# EAGLE design PCE128_rev_B (EAGLE 9.6.2)
PC Engine Joypad Breakout Version 1.0
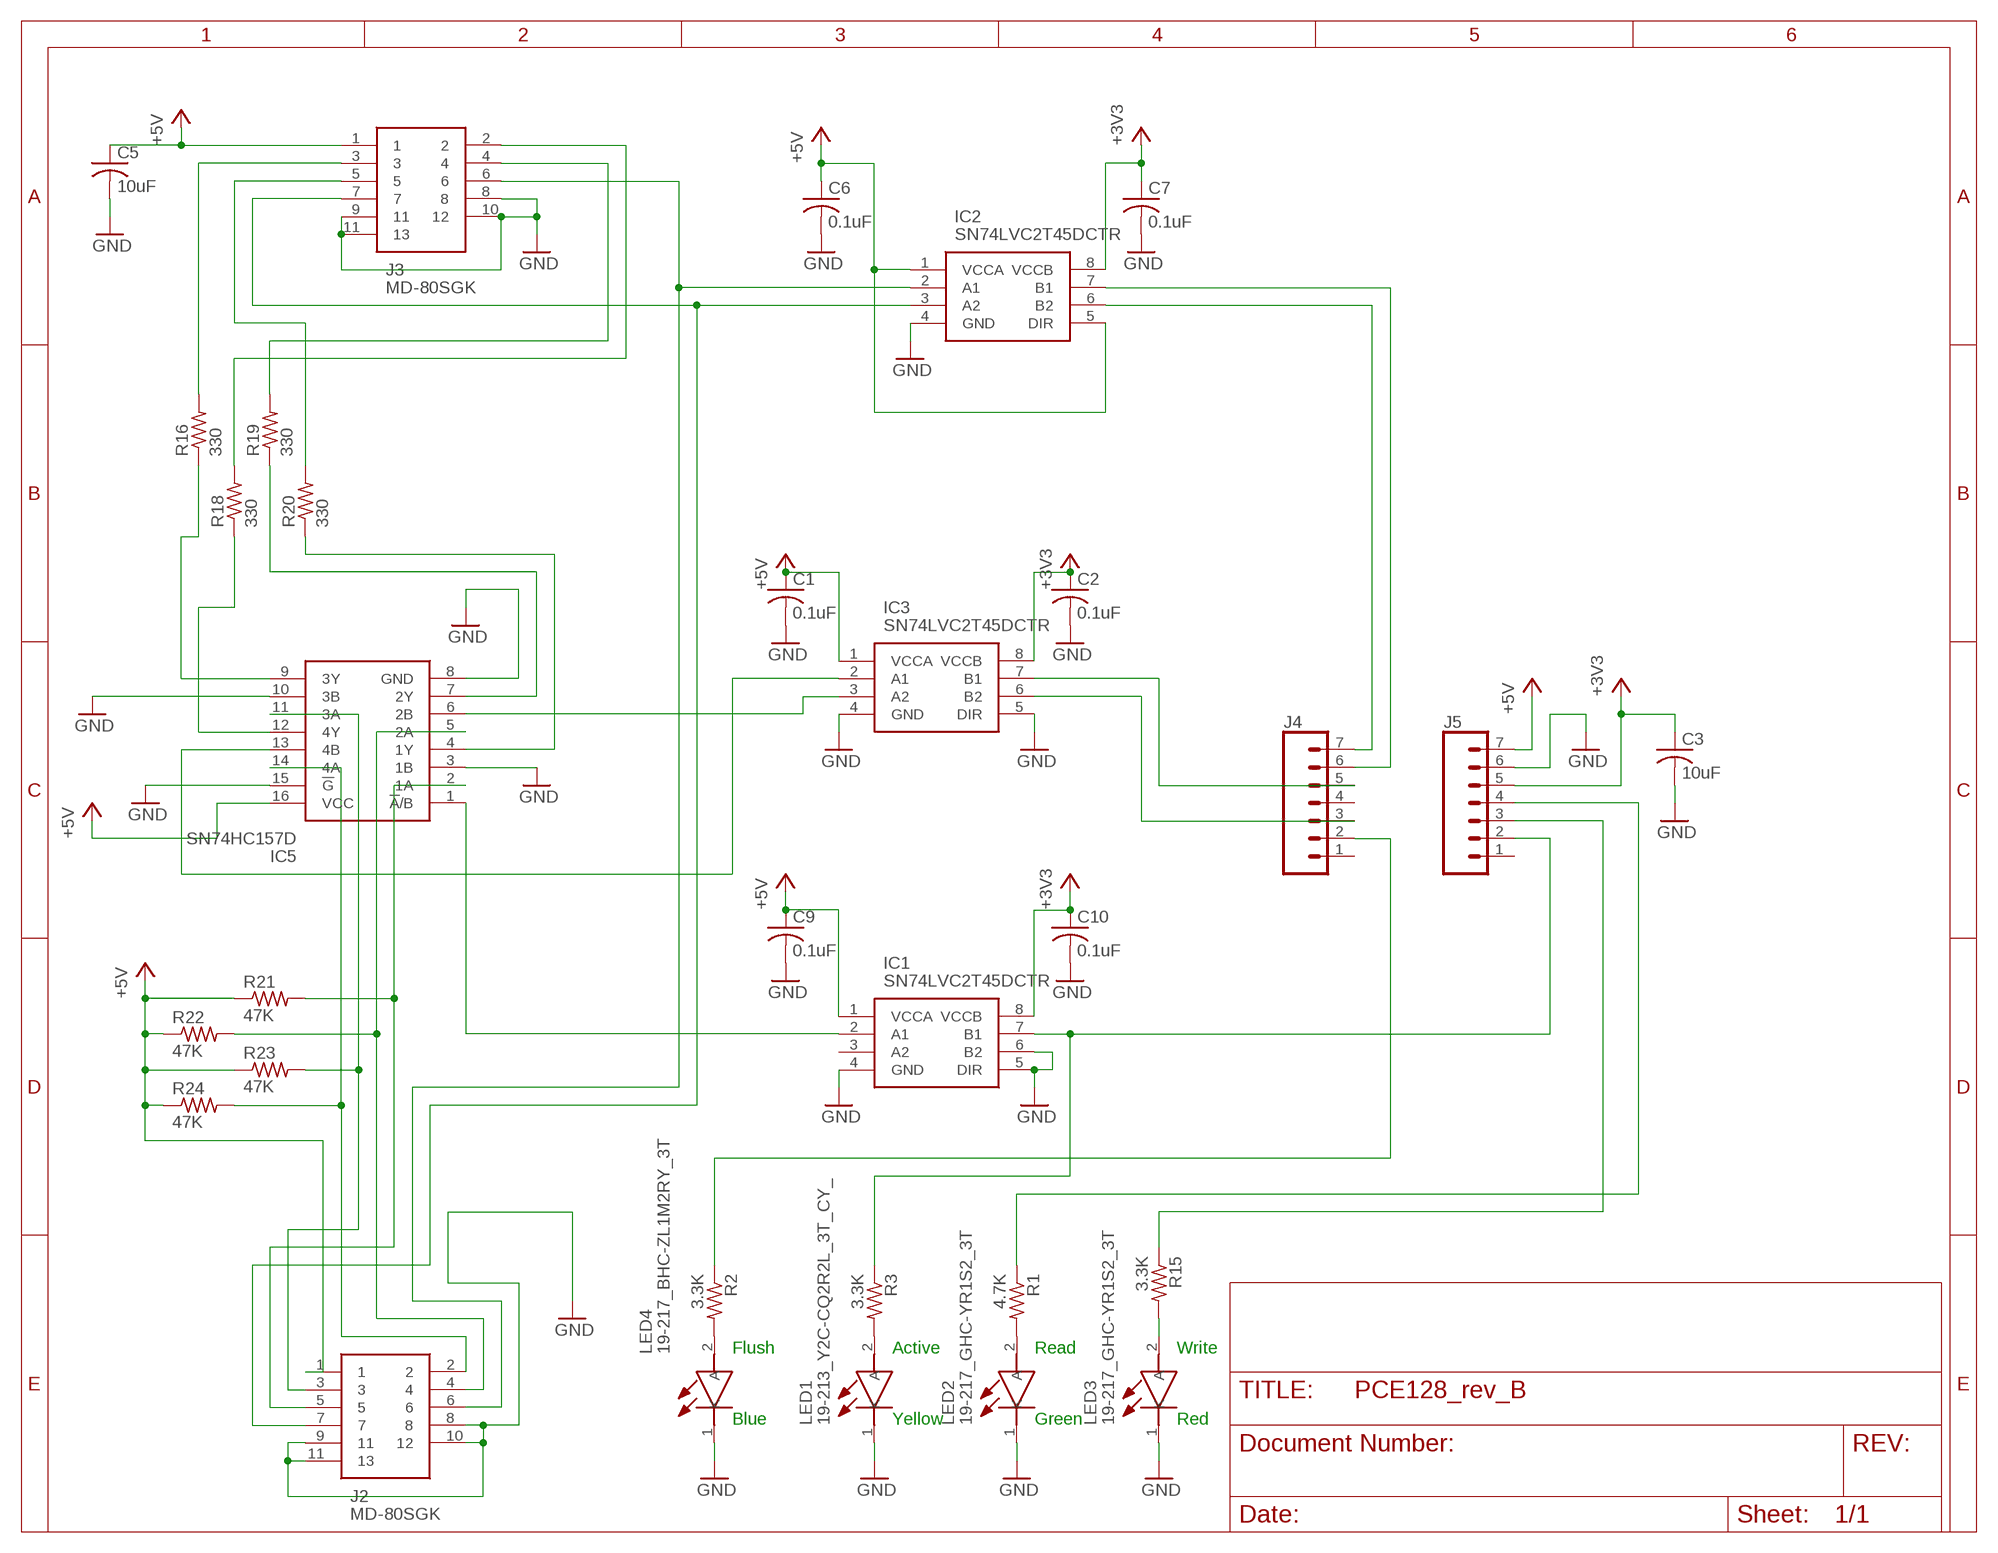
[diagram p0: schematic, sheet 1]

## Parts
C1  0.1uF  C-USC0402  [C0402]
C2  0.1uF  C-USC0402  [C0402]
C3  10uF  C-USC0805  [C0805]
C5  10uF  C-USC0805  [C0805]
C6  0.1uF  C-USC0402  [C0402]
C7  0.1uF  C-USC0402  [C0402]
C9  0.1uF  C-USC0402  [C0402]
C10  0.1uF  C-USC0402  [C0402]
IC1  SN74LVC2T45DCTR  [SOP65P400X130-8N]
IC2  SN74LVC2T45DCTR  [SOP65P400X130-8N]
IC3  SN74LVC2T45DCTR  [SOP65P400X130-8N]
IC5  SN74HC157D  [SOIC127P600X175-16N]
J2  MD-80SGK  [MD80SGK]
J3  MD-80SGK  [MD80SGK]
J4  CONN_07NO_SILK  [1X07_NO_SILK]
J5  CONN_07NO_SILK  [1X07_NO_SILK]
LED1  19-213_Y2C-CQ2R2L_3T_CY_  [LEDC1608X50N]
LED2  19-217_GHC-YR1S2_3T  [LEDC1608X50N]
LED3  19-217_GHC-YR1S2_3T  [LEDC1608X50N]
LED4  19-217_BHC-ZL1M2RY_3T  [LEDC1608X50N]
R1  4.7K  R-US_R0402  [R0402]
R2  3.3K  R-US_R0402  [R0402]
R3  3.3K  R-US_R0402  [R0402]
R15  3.3K  R-US_R0402  [R0402]
R16  330  R-US_R0402  [R0402]
R18  330  R-US_R0402  [R0402]
R19  330  R-US_R0402  [R0402]
R20  330  R-US_R0402  [R0402]
R21  47K  R-US_R0402  [R0402]
R22  47K  R-US_R0402  [R0402]
R23  47K  R-US_R0402  [R0402]
R24  47K  R-US_R0402  [R0402]

## Nets
+3V3 [power]: C2.1 C3.1 C7.1 C10.1 IC1.8(VCCB) IC2.8(VCCB) IC3.8(VCCB) J5.5
+5V [power]: C1.1 C5.1 C6.1 C9.1 IC1.1(VCCA) IC2.1(VCCA) IC2.5(DIR) IC3.1(VCCA) IC5.16(VCC) J2.1 J3.1 J5.7 R21.1 R22.1 R23.1 R24.1
CLR [signal]: IC2.3(A2) J2.7 J3.7
D0_IN [signal]: IC5.14(4A) J2.2 R24.2
D0_OUT: J3.2 R18.2
D1_IN [signal]: IC5.11(3A) J2.3 R23.2
D1_OUT: J3.3 R16.2
D2_IN: IC5.5(2A) J2.4 R22.2
D2_OUT: J3.4 R19.2
D3_IN: IC5.2(1A) J2.5 R21.2
D3_OUT: J3.5 R20.2
D6 [signal]: J5.3 R15.1
D10 [signal]: J5.4 R1.1
D11 [signal]: IC1.7(B1) J5.2 R3.1
GND: C1.2 C2.2 C3.2 C5.2 C6.2 C7.2 C9.2 C10.2 IC1.4(GND) IC1.5(DIR) IC1.6(B2) IC2.4(GND) IC3.4(GND) IC3.5(DIR) IC5.3(1B) IC5.8(GND) IC5.10(3B) IC5.15(!G) J2.8 J2.9 J2.10 J2.11 J3.8 J3.9 J3.10 J3.11 J5.6 LED1.1(K) LED2.1(K) LED3.1(K) LED4.1(K)
N$1: LED2.2(A) R1.2
N$2: J4.2 R2.1
N$3: IC3.7(B1) J4.5
N$4: LED4.2(A) R2.2
N$5: LED1.2(A) R3.2
N$6: IC3.6(B2) J4.3
N$7: IC3.3(A2) IC5.6(2B)
N$8: IC2.7(B1) J4.6
N$14: IC1.2(A1) IC5.1(!A!/B)
N$17: IC5.9(3Y) R16.1
N$20: IC5.12(4Y) R18.1
N$22: IC5.4(1Y) R20.1
N$24: IC5.7(2Y) R19.1
N$30: IC3.2(A1) IC5.13(4B)
N$32: IC2.6(B2) J4.7
N$36: LED3.2(A) R15.2
SEL [signal]: IC2.2(A1) J2.6 J3.6
Unconnected: IC1.3(A2) J4.1 J4.4 J5.1

## Notes on the sheet
- Flush | Active | Read | Write
- Blue | Yellow | Green | Red

## Library data of the parts
C1-C3 C5-C7 C9 C10 = resistor:C-US: CAPACITOR, American symbol
IC1-IC3 = SamacSys_Parts:SN74LVC2T45DCTR: 2-Bit Bus Transceiver, Translation SSOP8 SN74LVC2T45DCTR, Voltage Level Translator, Bus Transceiver LVC, 3-State 1.65 Source: Datasheet <http://www.ti.com/lit/ds/symlink/sn74lvc2t45.pdf>; DESCRIPTION: 2-Bit Bus Transceiver, Translation SSOP8 SN74LVC2T45DCTR, Voltage Level Translator, Bus Transceiver LVC, 3-State 1.65; HEIGHT: 1.3mm; MANUFACTURER_NAME: Texas Instruments; MANUFACTURER_PART_NUMBER: SN74LVC2T45DCTR; MOUSER_PART_NUMBER: 595-SN74LVC2T45DCTR; MOUSER_PRICE-STOCK: https://www.mouser.com/Search/Refine.aspx?Keyword=595-SN74LVC2T45DCTR; RS_PART_NUMBER: 9213022; RS_PRICE-STOCK: http://uk.rs-online.com/web/p/products/9213022
IC5 = PC-Engine:SN74HC157D: Quadruple 2-Line To 1-Line Data Selectors/Multiplexers Source: Datasheet <http://www.ti.com/lit/ds/symlink/sn74hc157.pdf>; ARROW_PART_NUMBER: SN74HC157D; ARROW_PRICE-STOCK: https://www.arrow.com/en/products/sn74hc157d/texas-instruments; DESCRIPTION: Quadruple 2-Line To 1-Line Data Selectors/Multiplexers; HEIGHT: 1.75mm; MANUFACTURER_NAME: Texas Instruments; MANUFACTURER_PART_NUMBER: SN74HC157D; MOUSER_PART_NUMBER: 595-SN74HC157D; MOUSER_PRICE-STOCK: https://www.mouser.co.uk/ProductDetail/Texas-Instruments/SN74HC157D?qs=UGVLDq%2F29uhSeVegTExyng%3D%3D
J2 J3 = SamacSys_Parts:MD-80SGK: Circular DIN Connectors mini-DIN, 8P jack, rt, through hole, full shield Source: Datasheet <https://www.cui.com/product/resource/md-sgk-series.pdf>; DESCRIPTION: Circular DIN Connectors mini-DIN, 8P jack, rt, through hole, full shield; HEIGHT: 13mm; MANUFACTURER_NAME: CUI; MANUFACTURER_PART_NUMBER: MD-80SGK; MOUSER_PART_NUMBER: 490-MD-80SGK; MOUSER_PRICE-STOCK: https://www.mouser.com/Search/Refine.aspx?Keyword=490-MD-80SGK
J4 J5 = SparkFun-Connectors:CONN_07: Multi connection point. Often used as Generic Header-pin footprint for 0.1 inch spaced/style header connections On any of the 0.1 inch spaced packages, you can populate with these: Break Away Headers - Straight <https://www.sparkfun.com/products/116> (PRT-00116) Break Away Male Headers - Right Angle <https://www.sparkfun.com/products/553> (PRT-00553) Female Headers <https://www.sparkfun.com/products/115> (PRT-00115) Break Away Headers - Machine Pin <https://www.sparkfun.com/products/117> (PRT-00117) Break Away Female Headers - Swiss Machine Pin <https://www.sparkfun.com/products/743> (PRT-00743) For SCREWTERMINALS and SPRING TERMINALS visit here: Screw Terimnals on SparkFun.com <https://www.sparkfun.com/search/results?term=Screw+Terminals> (5mm/3.5mm/2.54mm spacing) This device is also useful as a general connection point to wire up your design to another part of your project. Our various solder wires solder well into these plated through hole pads. Hook-Up Wire - Assortment (Stranded, 22 AWG) <https://www.sparkfun.com/products/11375> (PRT-11375) Hook-Up Wire - Assortment (Solid Core, 22 AWG) <https://www.sparkfun.com/products/11367> (PRT-11367) View the entire wire category on our website here <https://www.sparkfun.com/categories/141> Special notes: Molex polarized connector foot print use with SKU : PRT-08231 with associated crimp pins and housings. 1MM SMD Version SKU: PRT-10208 NOTES ON THE VARIANTS LOCK and LOCK_LONGPADS... This footprint was designed to help hold the alignment of a through-hole component (i.e. 6-pin header) while soldering it into place. You may notice that each hole has been shifted either up or down by 0.005 of an inch from it's more standard position (which is a perfectly straight line). This slight alteration caused the pins (the squares in the middle) to touch the edges of the holes. Because they are alternating, it causes a "brace" to hold the component in place. 0.005 has proven to be the perfect amount of "off-center" position when using our standard breakaway headers. Although looks a little odd when you look at the bare footprint, once you have a header in there, the alteration is very hard to notice. Also,if you push a header all the way into place, it is covered up entirely on the bottom side.
LED1 = PC-Engine:19-213_Y2C-CQ2R2L_3T_CY_: 0603 Package Chip LED (0.6mm Height) Source: Datasheet <https://datasheet.lcsc.com/szlcsc/Everlight-Elec-19-213-Y2C-CQ2R2L-3T-CY_C72038.pdf>; ARROW_PART_NUMBER: 19-213/Y2C-CQ2R2L/3T(CY); DESCRIPTION: 0603 Package Chip LED (0.6mm Height); HEIGHT: 0.6mm; MANUFACTURER_NAME: Everlight Elec; MANUFACTURER_PART_NUMBER: 19-213/Y2C-CQ2R2L/3T(CY)
LED2 = PC-Engine:19-217_GHC-YR1S2_3T: Standard LEDs - SMD Source: Datasheet <https://www.arrow.com/en/products/19-217ghc-yr1s23t/everlight-electronics>; ARROW_PART_NUMBER: 19-217/GHC-YR1S2/3T; ARROW_PRICE-STOCK: https://www.arrow.com/en/products/19-217ghc-yr1s23t/everlight-electronics; DESCRIPTION: Standard LEDs - SMD; HEIGHT: 0.5mm; MANUFACTURER_NAME: Everlight; MANUFACTURER_PART_NUMBER: 19-217/GHC-YR1S2/3T; MOUSER_PART_NUMBER: 638-19217GHCYR1S23T; MOUSER_PRICE-STOCK: https://www.mouser.co.uk/ProductDetail/Everlight/19-217-GHC-YR1S2-3T?qs=8cKuZ6Ok2lZjmFTUzVFjDg%3D%3D
LED3 = PC-Engine:19-217_GHC-YR1S2_3T: Standard LEDs - SMD Source: Datasheet <https://www.arrow.com/en/products/19-217ghc-yr1s23t/everlight-electronics>; ARROW_PART_NUMBER: 19-217/GHC-YR1S2/3T; ARROW_PRICE-STOCK: https://www.arrow.com/en/products/19-217ghc-yr1s23t/everlight-electronics; DESCRIPTION: Standard LEDs - SMD; HEIGHT: 0.5mm; MANUFACTURER_NAME: Hubei Kento; MANUFACTURER_PART_NUMBER: KT-0603R; MOUSER_PART_NUMBER: 638-19217GHCYR1S23T; MOUSER_PRICE-STOCK: https://www.mouser.co.uk/ProductDetail/Everlight/19-217-GHC-YR1S2-3T?qs=8cKuZ6Ok2lZjmFTUzVFjDg%3D%3D
LED4 = PC-Engine:19-217_BHC-ZL1M2RY_3T
R1-R3 R15 R16 R18-R24 = resistor:R-US_: RESISTOR, American symbol

## Net classes
0 default: width 0.152 mm, drill 0.356 mm, clearance 0.152 mm
1 power: width 0.305 mm, drill 0.356 mm, clearance 0.152 mm
2 signal: width 0.152 mm, drill 0.356 mm, clearance 0.152 mm

## Board
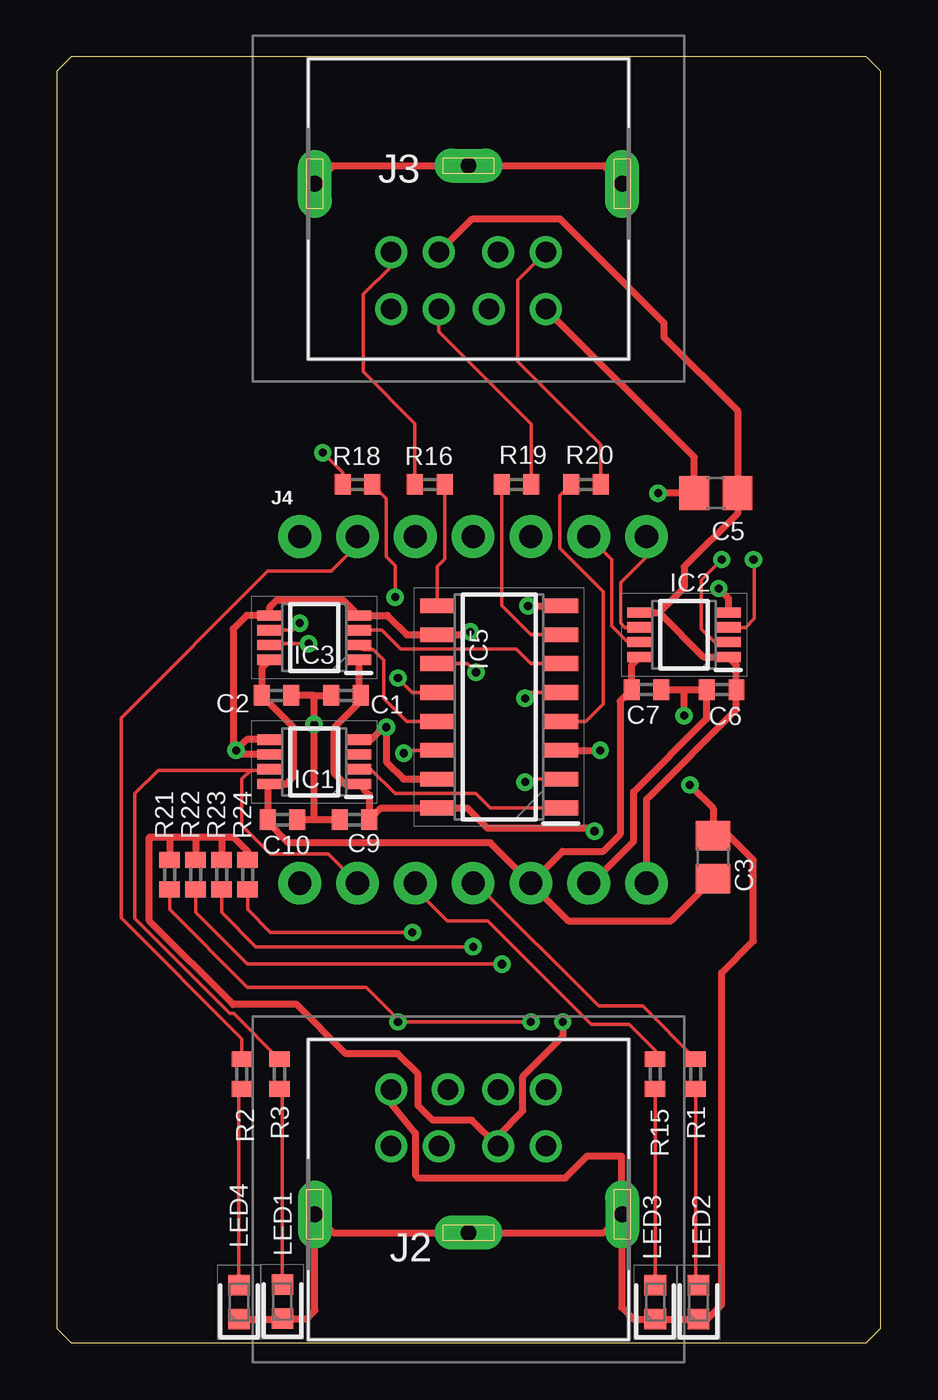
[diagram p1: board, top side]
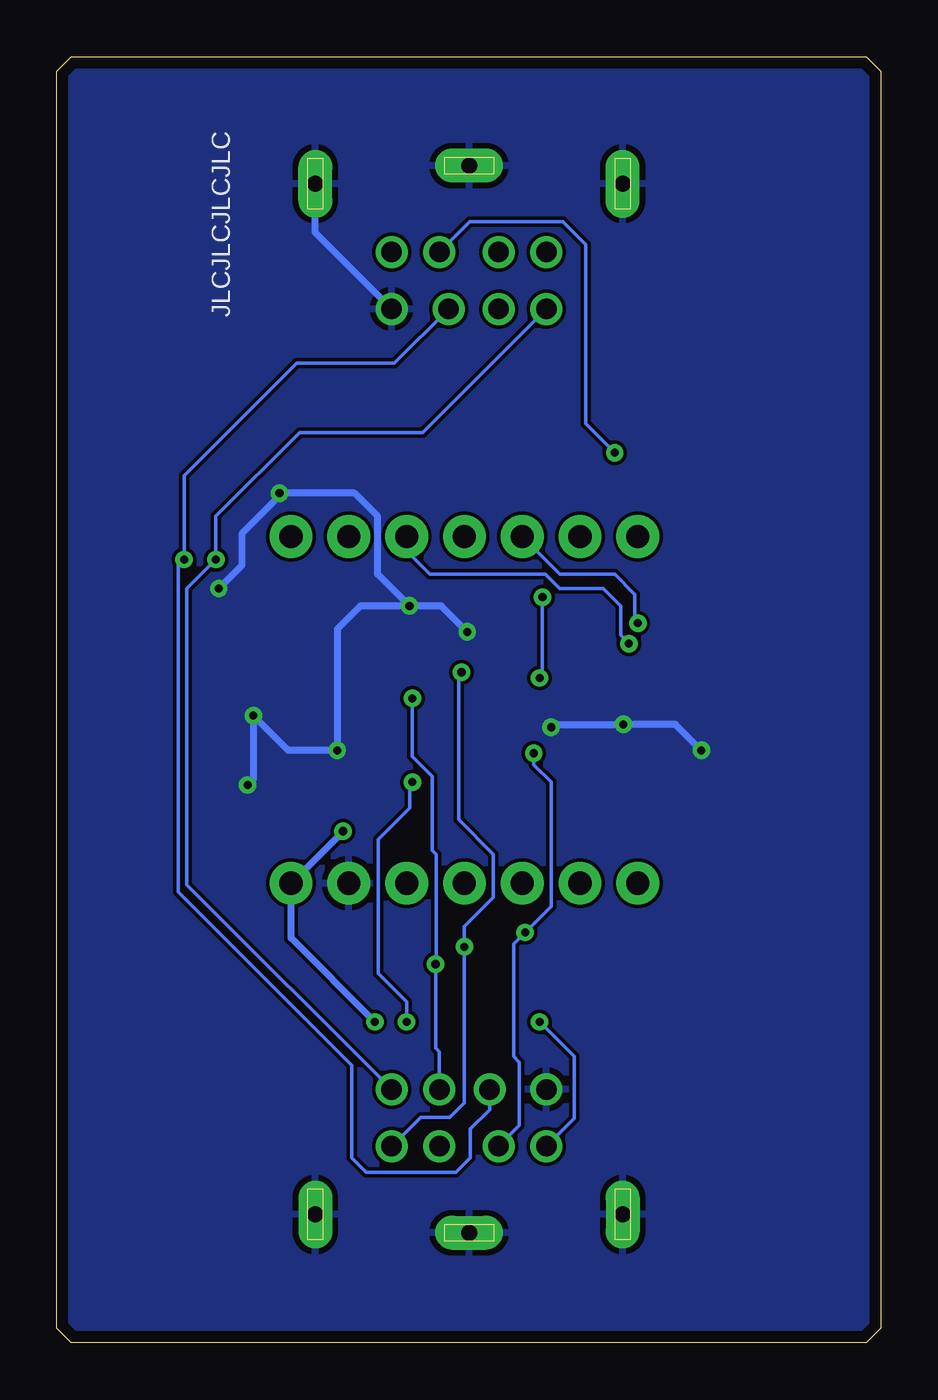
[diagram p2: board, bottom side, seen from below]

Size 36.2 x 56.52 mm. Coordinates in mm from the lower left corner, seen from the top.
Outline: 0,55.88 0,0.64 0.64,0 35.56,0 36.2,0.64 36.2,55.88 35.56,56.52 0.64,56.52 0,55.88
Copper layers (1*16): Top 0.035mm / dielectric 1.5mm / Bottom 0.035mm
Design rules "default *": minimum track width 6mil, minimum drill 0.35mm, track to track 6mil, track to pad 6mil, pad to pad 6mil, via to via 6mil, smd to smd 6mil, copper to edge 20mil, drill to drill 6mil, minimum pad ring 10mil, minimum via ring 8mil, stop-mask expansion 3mil, vias tented up to drill 18mil, thermal gap 10mil

### Footprints (pad centres in the part's own frame; a part is rotated, then mirrored left to right if it is on the bottom)
C0402 = smd 0.7 x 0.9: 1 -0.65,0; 2 0.65,0
C0805 = smd 1.3 x 1.5: 1 -0.95,0; 2 0.95,0
SOP65P400X130-8N = smd 1.1 x 0.45: 1 -1.95,0.975; 2 -1.95,0.325; 3 -1.95,-0.325; 4 -1.95,-0.975; 5 1.95,-0.975; 6 1.95,-0.325; 7 1.95,0.325; 8 1.95,0.975
SOIC127P600X175-16N = smd 1.525 x 0.65: 1 -2.712,4.445; 2 -2.712,3.175; 3 -2.712,1.905; 4 -2.712,0.635; 5 -2.712,-0.635; 6 -2.712,-1.905; 7 -2.712,-3.175; 8 -2.712,-4.445; 9 2.712,-4.445; 10 2.712,-3.175; 11 2.712,-1.905; 12 2.712,-0.635; 13 2.712,0.635; 14 2.712,1.905; 15 2.712,3.175; 16 2.712,4.445
MD80SGK = drill 0.9 pad 1.4: 1 -1.3,-1.9; 2 1.3,-1.9; 3 -3.4,-1.9; 4 -1.3,-4.4; 5 3.4,-1.9; 6 -3.4,-4.4; 7 0.9,-4.4; 8 3.4,-4.4 | drill 0.7 pad 1.5 long: 9 0,1.9; 10 -6.75,1.1; 11 6.75,1.1
1X07_NO_SILK = drill 1.016 pad 1.88: 1 0,0; 2 2.54,0; 3 5.08,0; 4 7.62,0; 5 10.16,0; 6 12.7,0; 7 15.24,0
LEDC1608X50N = smd 0.9 x 0.95: 1 -0.75,0; 2 0.75,0
R0402 = smd 0.7 x 0.9: 1 -0.65,0; 2 0.65,0

### Placement (x,y rotation side)
C1  12.7,28.45 180 top
C2  9.65,28.45 0 top
C3  28.83,21.34 90 top
C5  28.96,37.34 180 top
C6  29.21,28.7 180 top
C7  25.91,28.7 0 top
C9  13.08,22.99 180 top
C10  9.91,22.99 0 top
IC1  11.3,25.53 180 top
IC2  27.56,31.11 180 top
IC3  11.3,30.99 180 top
IC5  19.43,27.94 180 top
J2  18.08,6.73 180 top
J3  18.08,49.83 0 top
J4  10.67,35.43 0 top
J5  10.67,20.19 0 top
LED1  9.91,1.8 90 top
LED2  28.19,1.78 90 top
LED3  26.29,1.78 90 top
LED4  8,1.78 90 top
R1  28.07,11.81 270 top
R2  8.13,11.81 270 top
R3  9.78,11.81 270 top
R15  26.29,11.81 270 top
R16  16.38,37.72 180 top
R18  13.21,37.72 180 top
R19  20.19,37.72 0 top
R20  23.24,37.72 0 top
R21  4.95,20.57 270 top
R22  6.1,20.57 270 top
R23  7.24,20.57 270 top
R24  8.38,20.57 270 top

### Tracks (layer width: path | path; a pad name or v marks a point on that pad's centre or on a via)
+3V3
  Top 0.305: IC3.8 9,29.66 C2.1 10.41,27.04 10.41,24.89 10.07,24.55 IC1.8 9.26,24.45 C10.1 9.26,22.88 10.16,21.97 19.05,21.97 J5.5 | IC2.8 25.26,29.79 C7.1 24.75,28.19 24.75,22.34 24,21.59 22.23,21.59 J5.5 | J5.5 22.48,18.54 26.98,18.54 C3.1
+5V  (via drill 0.36)
  Top 0.305: IC3.1 13.25,28.55 C1.1 13.35,28.19 12.19,27.04 12.19,25.02 12.66,24.55 IC1.1 13.73,24.07 C9.1 14.24,23.5 IC5.16 18.03,23.5 18.92,22.61 23.5,22.61 v23.62,22.48 | J5.7 25.91,23.88 29.86,27.83 C6.1 29.86,29.79 IC2.1 28.41,30.14 26.46,32.09 | IC2.5 26.46,32.09 | J3.1 18.25,49.4 22.1,49.4 26.67,44.83 26.67,44.2 29.91,40.96 C5.1 29.91,36.45 27.56,34.1 27.56,33.19 26.46,32.09 | v22.23,14.1 22.23,13.46 20.48,11.71 20.48,10.19 19.39,9.1 J2.1 18.24,9.78 16.51,9.78 15.88,10.41 15.88,11.81 14.99,12.7 12.7,12.7 10.54,14.86 7.75,14.86 4.06,18.54 4.06,22.23 4.95,22.23 | 4.95,22.23 6.1,22.23 | 6.1,22.23 7.24,22.23 | 7.24,22.23 7.75,22.23 8.38,21.59 R24.1 | 7.24,22.23 R23.1 | 6.1,22.23 R22.1 | 4.95,22.23 R21.1
  Bottom 0.305: v23.62,22.48 J5.7 25.91,17.78 v22.23,14.1
CLR  (via drill 0.36)
  Top 0.152: IC2.3 30.27,31.44 30.65,31.82 30.65,34.37 v30.61,34.42
  Bottom 0.152: J3.7 21.37,43.05 25.65,43.05 30.61,38.1 v30.61,34.42 30.86,34.16 30.86,19.81 23.24,12.19 23.24,8.13 22.61,7.49 18.67,7.49 18.03,8.13 18.03,9.39 17.18,10.24 J2.7
D0_IN  (via drill 0.36)
  Top 0.152: v15.24,25.91 15.37,26.04 IC5.14 | v15.62,18.03 9.38,18.03 8.38,19.04 R24.2
  Bottom 0.152: J2.2 15.88,9.54 15.88,12.32 16.13,12.57 16.13,17.53 v15.62,18.03 14.48,19.18 14.48,24.64 15.24,25.4 v15.24,25.91
D0_OUT  (via drill 0.36)
  Top 0.152: R18.2 12.56,38.24 v11.68,39.12
  Bottom 0.152: J3.2 18.04,49.28 13.97,49.28 12.95,48.26 12.95,40.39 v11.68,39.12
D1_IN  (via drill 0.36)
  Top 0.152: v18.41,29.46 18.03,29.84 IC5.11 | R23.2 7.24,18.91 8.75,17.4 v18.29,17.4
  Bottom 0.152: J2.3 20.21,9.91 18.92,9.91 18.29,10.54 v18.29,17.4 18.29,18.29 17.02,19.56 17.02,21.46 18.54,22.99 18.54,29.34 v18.41,29.46
D1_OUT
  Top 0.152: J3.3 14.69,47.3 13.46,46.08 13.46,42.67 15.73,40.4 R16.2
D2_IN  (via drill 0.36)
  Top 0.152: v20.57,28.32 20.83,28.57 IC5.5 | R22.2 6.1,18.91 8.37,16.64 v19.56,16.64
  Bottom 0.152: J2.4 19.39,12.78 19.56,12.95 v19.56,16.64 19.53,16.66 19.53,21.46 19.71,21.64 19.71,24.89 20.57,25.75 v20.57,28.32
D2_OUT
  Top 0.152: J3.4 16.79,44.43 20.84,40.37 R19.2
D3_IN  (via drill 0.36)
  Top 0.152: v20.57,24.64 20.7,24.77 IC5.2 | v20.83,14.1 15.11,14.1 | 15.11,14.1 v14.99,14.1 | R21.2 4.95,19.04 8.37,15.62 13.59,15.62 15.11,14.1
  Bottom 0.152: v20.83,14.1 20.83,14.99 22.07,16.23 22.07,22.12 20.7,23.5 20.7,24.51 v20.57,24.64 | v14.99,14.1 13.46,12.57 13.46,9.85 J2.5
D3_OUT
  Top 0.152: J3.5 20.24,46.69 20.24,43.13 23.89,39.48 R20.2
D6
  Top 0.152: J5.3 15.75,19.94 17.14,18.54 18.92,18.54 23.48,13.98 25.15,13.98 26.29,12.84 R15.1
D10
  Top 0.152: J5.4 18.41,20.19 23.81,14.8 25.73,14.8 R1.1
D11
  Top 0.152: IC1.7 9.3,25.15 8.51,25.15 | 8.51,25.15 8.13,24.77 8.13,22.73 9.37,21.49 11.91,21.49 J5.2 | R3.1 7.76,14.48 7.59,14.48 3.43,18.64 3.43,24.13 4.45,25.15 8.51,25.15
GND  (via drill 0.36)
  Top 0.305: J2.8 14.69,10.5 15.75,9.21 15.75,7.37 15.88,7.24 22.34,7.24 23.29,8.19 24.82,8.19 24.82,5.65 | 24.82,5.65 J2.10 24.04,4.83 J2.9 12.13,4.83 J2.11 11.34,1.4 10.98,1.05 10.96,1.05 LED1.1 9.88,1.03 LED4.1 | J3.10 12.14,51.74 J3.9 24.04,51.73 J3.11 | 24.82,5.65 24.82,1.55 25.34,1.03 LED3.1 LED2.1 28.57,1.03 29.21,1.66 29.21,16.26 30.61,17.65 30.61,21.21 29.53,22.29 C3.2 28.83,23.5 v27.81,24.51 | C10.2 11.3,22.99 | 11.3,22.99 C9.2 | 11.3,22.99 v11.3,27.18 11.3,28.45 | 11.3,28.45 C1.2 | 11.3,28.45 C2.2 | J5.6 23.5,20.19 25.34,22.04 25.34,24.21 28.56,27.43 C6.2 27.56,28.7 | C7.2 27.56,28.7 | IC1.6 8.06,25.85 v7.87,26.04 | IC1.4 13.8,26.5 14.35,27.05 v14.48,27.05 14.48,25.53 15.24,24.77 IC5.15 | IC1.5 8.34,26.5 v7.87,26.04 | v27.56,27.56 27.56,28.7 | IC5.3 v23.88,26.04 | v18.16,31.24 18.03,31.11 IC5.10 15.37,31.11 14.52,31.96 IC3.4 12.58,32.64 9.65,32.64 9.35,32.34 IC3.5 8.34,31.96 7.75,31.37 7.75,26.16 v7.87,26.04 | v20.7,32.38 IC5.8 | J3.8 28.01,38.91 C5.2 v26.42,37.34 | v29.08,33.15 29.51,32.72 IC2.4
  Bottom 0.305: J3.8 24.84,48.78 J3.11 | v7.87,26.04 9.02,27.18 v11.3,27.18 14.35,27.18 v14.48,27.05 | v18.16,31.24 19.3,32.38 v20.7,32.38 | v20.7,32.38 22.86,32.38 23.88,31.37 v23.88,26.04 26.04,26.04 v27.56,27.56 27.56,24.77 v27.81,24.51 | v20.7,32.38 22.1,33.78 22.1,36.32 23.11,37.34 v26.42,37.34 26.42,37.21 28.07,35.56 28.07,34.16 v29.08,33.15
  pour Bottom: -0.51,-0.51 -0.51,56.9 38.1,56.9 38.1,-0.51
N$1
  Top 0.152: LED2.2 28.07,2.65 R1.2
N$2
  Top 0.152: R2.1 8.13,13.36 2.82,18.67 2.82,27.46 9.27,33.91 12.06,33.91 13.21,35.05 J4.2
N$3  (via drill 0.36)
  Top 0.152: v11.06,30.72 9.41,30.72 IC3.7
  Bottom 0.152: J4.5 20.83,34.8 19.81,33.78 14.73,33.78 14.1,33.15 12.19,33.15 11.43,32.38 11.43,31.09 v11.06,30.72
N$4
  Top 0.152: LED4.2 8,11.03 R2.2
N$5
  Top 0.152: R3.2 9.91,11.03 LED1.2
N$6  (via drill 0.36)
  Top 0.152: v10.67,31.62 10.36,31.31 IC3.6
  Bottom 0.152: v10.67,31.62 10.79,31.75 10.79,32.89 11.68,33.78 14.1,33.78 J4.3
N$7
  Top 0.152: IC3.3 14.28,31.31 15.11,30.48 20.19,30.48 20.83,29.84 IC5.6
N$8
  Top 0.152: IC2.7 25.09,30.79 24.38,31.5 24.38,34.42 J4.6
N$14
  Top 0.152: IC1.2 13.79,25.2 14.86,24.13 18.41,24.13 19.05,23.5 IC5.1
N$17
  Top 0.152: IC5.9 16.72,34.12 17.03,34.43 R16.1
N$20  (via drill 0.36)
  Top 0.152: IC5.12 15.62,28.57 v14.99,29.21 | R18.1 14.48,37.1 14.48,34.54 14.86,34.16 v14.86,32.77
  Bottom 0.152: v14.99,29.21 14.86,29.34 v14.86,32.77
N$22
  Top 0.152: IC5.4 23.24,27.3 24,28.07 24,33.02 22.1,34.92 22.1,37.23 R20.1
N$24
  Top 0.152: IC5.7 20.83,31.11 19.54,32.4 R19.1
N$30
  Top 0.152: IC3.2 13.45,30.47 13.9,30.47 14.35,30.01 14.35,28.32 15.37,27.3 IC5.13
N$32
  Top 0.152: IC2.6 24.95,31.44 24.77,31.62 24.77,33.4 25.91,34.54 J4.7
N$36
  Top 0.152: LED3.2 R15.2
SEL  (via drill 0.36)
  Top 0.152: v29.21,34.42 28.32,33.53 28.32,31.37 28.9,30.79 IC2.2
  Bottom 0.152: J3.6 20.11,40.01 25.53,40.01 29.21,36.32 v29.21,34.42 30.48,33.15 30.48,20.13 J2.6

### Text on the board
bNames: JLCJLCJLCJLC
tValues: PCE128, rev. B | (C)2021 David Shadoff